# Altium schematic sheet Sheet3.SchDoc
size 300 x 250 mm; SheetNumber: 1; SheetTotal: 1
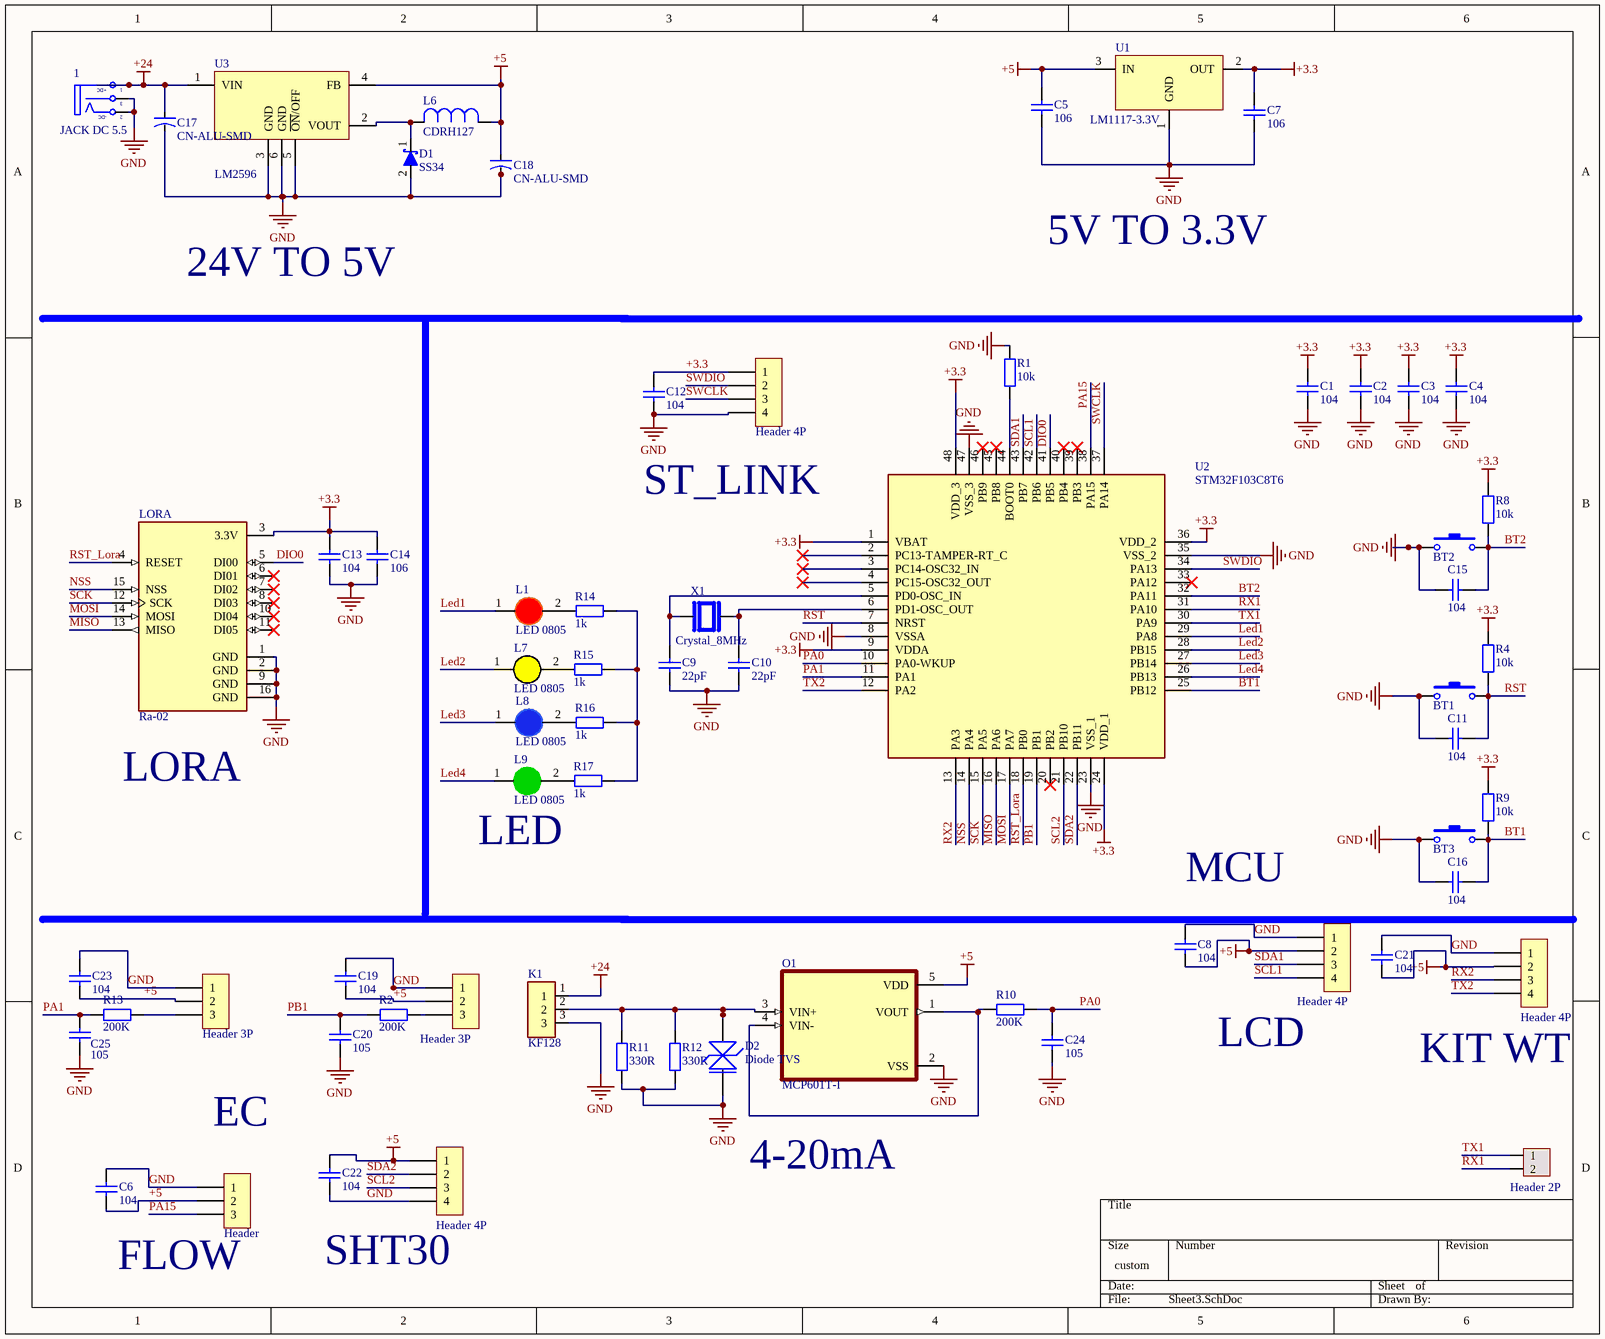
[diagram p0: Sheet3.SchDoc]

## Parts
1  JACK DC 5.5  [JACK DC 5.5]
BT1  Nut Nhan 2 Chan SMD 3x6x2.5  [Nut Nhan 2 Chan SMD 3x6x2.5]  (value not drawn)
BT2  Nut Nhan 2 Chan SMD 3x6x2.5  [Nut Nhan 2 Chan SMD 3x6x2.5]  (value not drawn)
BT3  Nut Nhan 2 Chan SMD 3x6x2.5  [Nut Nhan 2 Chan SMD 3x6x2.5]  (value not drawn)
C1  104  [tu 1206]
C2  104  [tu 1206]
C3  104  [tu 1206]
C4  104  [tu 1206]
C5  106  [tu 1206]
C6  104  [tu 1206]
C7  106  [tu 1206]
C8  104  [tu 1206]
C9  22pF  [tu 1206]
C10  22pF  [tu 1206]
C11  104  [tu 1206]
C12  104  [tu 1206]
C13  104  [tu 1206]
C14  106  [tu 1206]
C15  104  [tu 1206]
C16  104  [tu 1206]
C17  CN-ALU-SMD  [CAP-ALU-SMD-H]
C18  CN-ALU-SMD  [CAP-ALU-SMD-D]
C19  104  [tu 1206]
C20  105  [tu 1206]
C21  104  [tu 1206]
C22  104  [tu 1206]
C23  104  [tu 1206]
C24  105  [tu 1206]
C25  105  [tu 1206]
D1  SS34  [DO-214AC]
D2  Diode TVS  [DO-214AC]
FLOW  Header  [XH2.54M-3]
H1  Header 2P  [XH2.54M-2]
K1  KF128  [KF128_3V]
KIT  Header 4P  [XH2.54M-4]
L1  LED 0805  [LED-1206-Red]
L6  CDRH127  [33uH]
L7  LED 0805  [LED-1206-Yellow]
L8  LED 0805  [LED-1206-Blue]
L9  LED 0805  [LED-1206-Green]
LCD  Header 4P  [XH2.54M-4]
LORA  Ra-02  [Sx1278]
O1  MCP601T-I  [MCP601T-I]
R1  10k  [tro smd 1206]
R2  200K  [tro smd 1206]
R4  10k  [tro smd 1206]
R8  10k  [tro smd 1206]
R9  10k  [tro smd 1206]
R10  200K  [tro smd 1206]
R11  330R  [tro smd 1206]
R12  330R  [tro smd 1206]
R13  200K  [tro smd 1206]
R14  1k  [Tro smd 1206]
R15  1k  [Tro smd 1206]
R16  1k  [Tro smd 1206]
R17  1k  [Tro smd 1206]
SAL  Header 3P  [XH2.54M-3]
SHT3x  Header 4P  [XH2.54M-4]
ST  Header 4P  [XH2.54M-4]
TEMP_W  Header 3P  [XH2.54M-3]
U1  LM1117-3.3V  [SOT223]
U2  STM32F103C8T6  [LQFP-48_19.6_393_58X11_SMD]
U3  LM2596  [TO263-5]
X1  Crystal_8MHz  [XTAL_8MHz]

## Nets
+3.3: C1.1 C2.1 C3.1 C4.1 C7.1 C12.2 C13.1 C14.1 LORA.3(3.3V) R4.2 R8.2 R9.2 ST.1 U1.2(OUT) U2.1(VBAT) U2.9(VDDA) U2.24(VDD_1) U2.36(VDD_2) U2.48(VDD_3)
+5: C5.1 C6.2 C8.2 C18.1 C19.2 C21.2 C22.1 C23.2 FLOW.2 KIT.2 L6.1 LCD.2 O1.5(VDD) SAL.2 SHT3x.1 TEMP_W.2 U1.3(IN) U3.4(FB)
+24: 1.1(T) C17.1 K1.1 U3.1(VIN)
GND: 1.2(TN) 1.3(S) BT1.1 BT2.1 BT3.1 C1.2 C2.2 C3.2 C4.2 C5.2 C6.1 C7.2 C8.1 C9.2 C10.2 C11.1 C12.1 C13.2 C14.2 C15.1 C16.1 C17.2 C18.2 C19.1 C20.2 C21.1 C22.2 C23.1 C24.2 C25.2 D1.2(A) D2.2 FLOW.1 K1.3 KIT.1 LCD.1 LORA.1(GND) LORA.2(GND) LORA.9(GND) LORA.16(GND) O1.2(VSS) R1.2 R11.2 R12.2 SAL.1 SHT3x.4 ST.4 TEMP_W.1 U1.1(GND) U2.8(VSSA) U2.23(VSS_1) U2.35(VSS_2) U2.47(VSS_3) U3.3(GND) U3.5(~{ON}/OFF) U3.6(GND)
BT1: BT3.2 C16.2 R9.1 U2.25(PB12)
BT2: BT2.2 C15.2 R8.1 U2.32(PA11)
DIO0: LORA.5(DI00) U2.41(PB5)
Led1: L1.1(A) U2.29(PA8)
Led2: L7.1(A) U2.28(PB15)
Led3: L8.1(A) U2.27(PB14)
Led4: L9.1(A) U2.26(PB13)
MISO: LORA.13(MISO) U2.16(PA6)
MOSI: LORA.14(MOSI) U2.17(PA7)
NSS: LORA.15(NSS) U2.14(PA4)
PA0: C24.1 R10.2 U2.10(PA0-WKUP)
PA1: C25.1 R13.1 U2.11(PA1)
PA15: FLOW.3 U2.38(PA15)
PB1: C20.1 R2.1 U2.19(PB1)
RST: BT1.2 C11.2 R4.1 U2.7(NRST)
RST_Lora: LORA.4(RESET) U2.18(PB0)
RX1: H1.2 U2.31(PA10)
RX2: KIT.3 U2.13(PA3)
SCK: LORA.12(SCK) U2.15(PA5)
SCL1: LCD.4 U2.42(PB6)
SCL2: SHT3x.3 U2.21(PB10)
SDA1: LCD.3 U2.43(PB7)
SDA2: SHT3x.2 U2.22(PB11)
SWCLK: ST.3 U2.37(PA14)
SWDIO: ST.2 U2.34(PA13)
TX1: H1.1 U2.30(PA9)
TX2: KIT.4 U2.12(PA2)
NetC9_1: C9.1 U2.5(PD0-OSC_IN) X1.1
NetC10_1: C10.1 U2.6(PD1-OSC_OUT) X1.2
NetD1_1: D1.1(K) L6.2 U3.2(VOUT)
NetD2_1: D2.1 K1.2 O1.3(VIN+) R11.1 R12.1
NetL1_2: L1.2(K) R14.2
NetL7_2: L7.2(K) R15.1
NetL8_2: L8.2(K) R16.1
NetL9_2: L9.2(K) R17.1
NetO1_1: O1.1(VOUT) O1.4(VIN-) R10.1
NetR1_1: R1.1 U2.44(BOOT0)
NetR2_2: R2.2 SAL.3
NetR13_2: R13.2 TEMP_W.3
NetR14_1: R14.1 R15.2 R16.2 R17.2

Not connected (* = marked no-connect by the designer): LORA 6(DI01)* 7(DI02)* 8(DI03)* 10(DI04)* 11(DI05)*; U2 2(PC13-TAMPER-RT_C)* 3(PC14-OSC32_IN)* 4(PC15-OSC32_OUT)* 20(PB2)* 33(PA12)* 39(PB3)* 40(PB4)* 45(PB8)* 46(PB9)*

## Notes on the sheet
- 24V TO 5V
- 5V TO 3.3V
- ST_LINK
- (near LORA) LORA
- LED
- (near C8) MCU
- LCD
- (near KIT) KIT WT
- EC
- 4-20mA
- FLOW
- (near SHT3x) SHT30
- (in symbol JACK DC 5.5) +DC; -DC

## Library data of the parts
1 = JACK DC 5.5: Value: Jac DC
BT1-BT3 = Nut Nhan 2 Chan SMD 3x6x2.5: Ma_Hang: MH001036; Ten: Nút Nhấn 2 Chân 3x6x2.5MM SMD
C1-C4 C6 C8-C13 C15 C16 C19 C21-C23 = Tu 1206 104 50V 20%: Dán; Don_Vi: Con; So_Chan: 2; Ten_Linh_Kien: Tụ 1206 104-0.1uF 20% 50V; Ma_Hang: MH004544; Chung_Loai: Dán; Kieu_Chan: *
C5 C7 C14 = Tu 1206 106 16V 20%: Dán; Don_Vi: Con; So_Chan: 2; Ten_Linh_Kien: Tụ 1206 106-10uF 20% 16V; Ma_Hang: MH004541; Chung_Loai: Dán; Kieu_Chan: *
C17 C18 = CN-ALU-SMD: Polarized Capacitor (Axial); Published: 8-Jun-2000; LatestRevisionDate: 17-Jul-2002; LatestRevisionNote: Re-released for DXP Platform.; PackageReference: POLAR0.8; Publisher: Altium Limited
C20 C24 C25 = Tu 1206 105 50V 20%: Dán; Don_Vi: Con; So_Chan: 2; Ten_Linh_Kien: Tụ 1206 105-1uF 20% 50V; Ma_Hang: MH004545; Chung_Loai: Dán; Kieu_Chan: *
D1 = SS54: Diode Schottky 40 V 5A Surface Mount DO-214AC (SMA)
D2 = Diode TVS: TVS Diodes - Transient Voltage Suppressors; Published: 8-Jun-2000; LatestRevisionDate: 17-Jul-2002; LatestRevisionNote: Re-released for DXP Platform.; PackageVersion: Sep-1996; PackageReference: SMC; Publisher: Altium Limited; Code_JEDEC: DO-214-AB
FLOW SAL TEMP_W = Header 3P 2.54 Duc Thang: Cắm; Ten_Linh_Kien: Header 3P XH2.54-3P Đực Thẳng; Don_Vi: Con; Ma_Hang: MH001292; Chung_Loai: Cắm
H1 = Header 2P 2.54 Duc Thang: Cắm; Ten_Linh_Kien: Header 2P XH2.54-2P Đực Thẳng; Don_Vi: Con; Ma_Hang: MH001283; Chung_Loai: Cắm
K1 = KF128_3V: KF128-3-V Domino 3 Chân Thẳng 2.54mm 150V 6A Hàn PCB
KIT LCD SHT3x ST = Header 4P 2.54 Duc Thang: Cắm; Ten_Linh_Kien: Header 4P XH2.54-4P Đực Thẳng; Don_Vi: Con; Ma_Hang: MH001285; Chung_Loai: Cắm
L1 = LED 1206 Do: Dán; Don_Vi: Con; Ma_Hang: MH002334; Ten_Linh_Kien: LED1206 Màu Đỏ (Red); Ghi_Chu: *; Kieu_Chan: *; Chung_Loai: Dán
L6 = CDRH127: 33uH - Inductor 4.2 A
L7 = LED 1206 Vang: Dán; Don_Vi: Con; Ma_Hang: MH002331; Ten_Linh_Kien: LED1206 Màu Vàng (Yellow); Ghi_Chu: *; Kieu_Chan: *; Chung_Loai: Dán
L8 = LED 1206 Xanh Duong: Dán; Don_Vi: Con; Ma_Hang: MH002333; Ten_Linh_Kien: LED1206 Màu Xanh Dương (Blue); Ghi_Chu: *; Kieu_Chan: *; Chung_Loai: Dán
L9 = LED 1206 Xanh La: Dán; Don_Vi: Con; Ma_Hang: MH002947; Ten_Linh_Kien: LED1206 Màu Xanh Lá (Green); Ghi_Chu: *; Kieu_Chan: *; Chung_Loai: Dán
LORA = Ra-02: Lora sx1278
O1 = MCP601T-I: MCP601T-I/OT IC OPAMP General Purpose Amplifier 1 Circuit 2.8MHz, 5-SOT-23
R1 R4 R8 R9 = Tro 1206 1% 10k: Dán; Don_Vi: Con; So_Chan: 2; Ten_Linh_Kien: Trở 1206 1% 10k; Ma_Hang: MH005885; Chung_Loai: Dán; Kieu_Chan: *
R2 R10 R13 = Tro 1206 5% 100K: Dán; Don_Vi: Con; So_Chan: 2; Ten_Linh_Kien: Trở 1206 5% 100k; Ma_Hang: MH005921; Chung_Loai: Dán; Kieu_Chan: *
R11 R12 = Tro 1206 1% 10R: Dán; Don_Vi: Con; So_Chan: 2; Ten_Linh_Kien: Trở 1206 1% 10R; Ma_Hang: MH005886; Chung_Loai: Dán; Kieu_Chan: *
R14-R17 = Tro 1206 5% 390R: Dán; Don_Vi: Con; So_Chan: 2; Ten_Linh_Kien: Trở 1206 5% 390R; Ma_Hang: MH005927; Chung_Loai: Dán; Kieu_Chan: *
U1 = LM1117: 800mA Low-Dropout Linear Regulator; Creator: Nguyen Ba Bien; Website: http://group3i.net
U2 = IC_STM32F103C8T6: ARM® Cortex®-M3 STM32F1 Microcontroller IC 32-Bit 72MHz 64KB (64K x 8) FLASH 48-LQFP (7x7); Manufacturer: STMicroelectronics; Alternate Part Number-1: NA; Manufacturer Part Number: STM32F103C8T6; Case/Package: LQFP48; Supplier-1: LCSC; Supplier Part Number-1: STM32F103C8T6
U3 = LM2596: 1A Regulator
X1 = Crystal_8MHz: 8MHz